# Altium schematic sheet Peripherals.SchDoc: Peripherals
size A4; Date: 9/24/2014; Author: P.A.; CompanyName: STMicroelectronics; Organization: Microcontrollers Division; Address1: 12, Rue Jules HOROWITZ; Address2: 38019 Grenoble; Address3: FRANCE; DocumentNumber: MB1189; Revision: B-07; SheetNumber: 11; SheetTotal: 13; Project: STM32F469I-DISCO
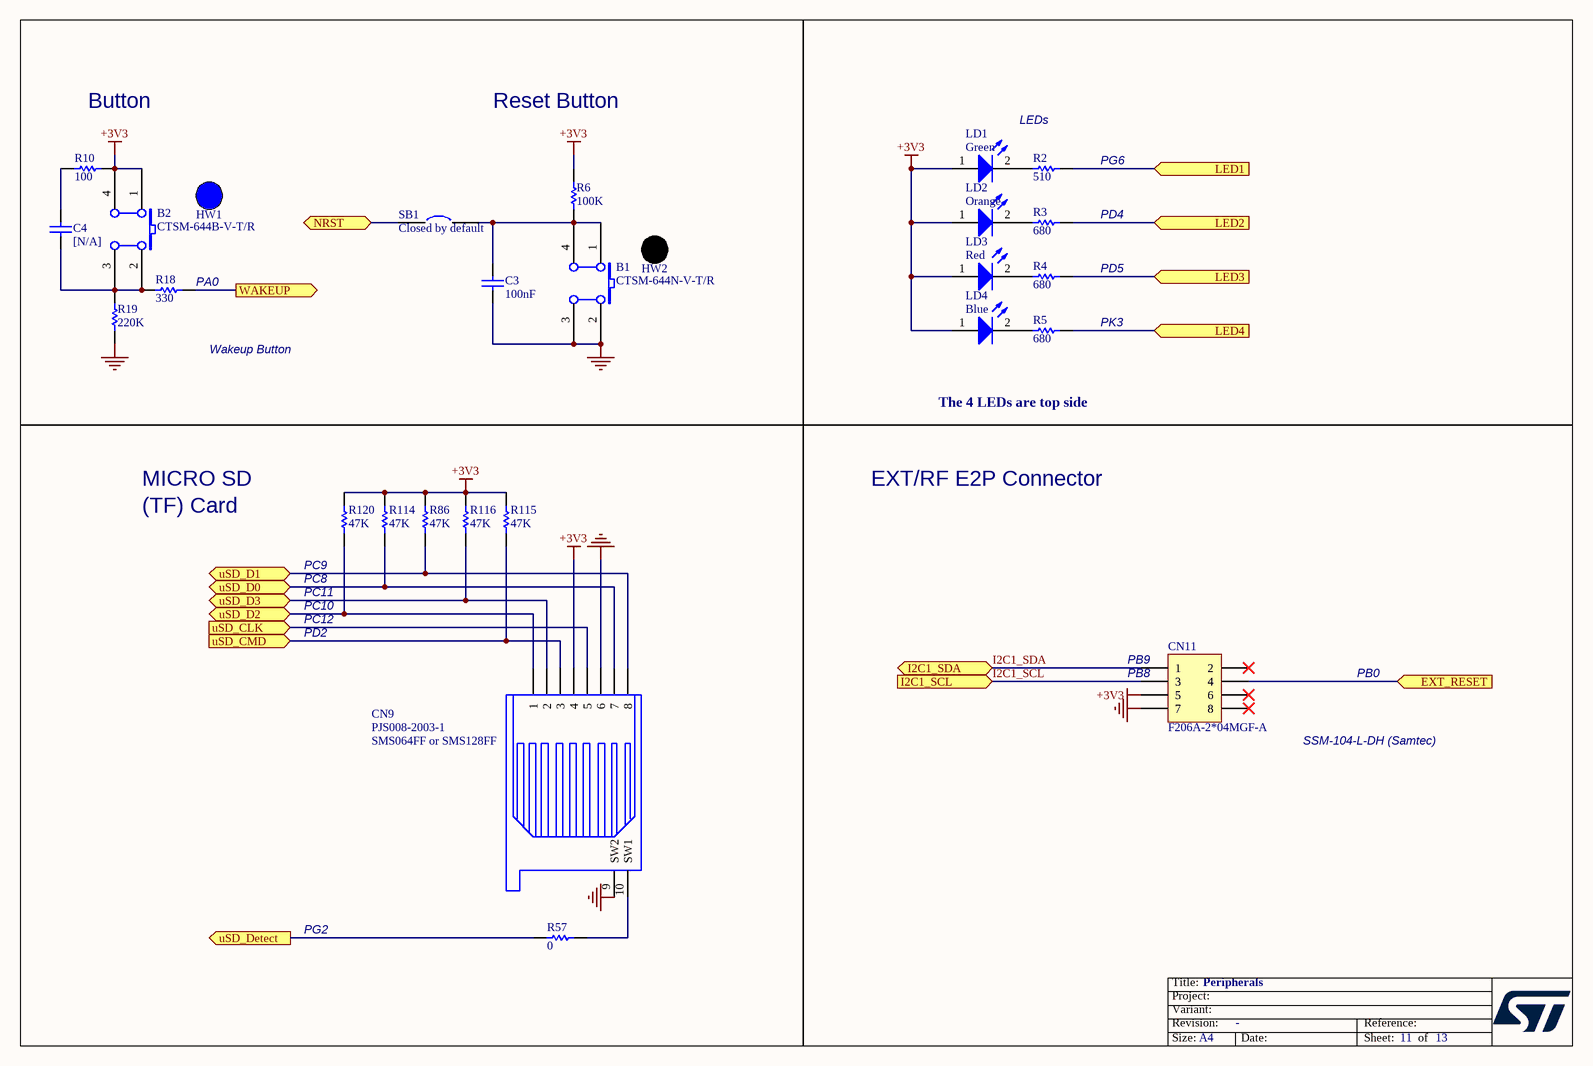
[diagram p0: Peripherals.SchDoc]

## Parts
B1  CTSM-644N-V-T/R  [PB10]
B2  CTSM-644B-V-T/R  [PB10]
C3  100nF  [0402C]
C4  [N/A]  [0603C]
CN9  PJS008-2003-1  [MSD_PJS008_]
CN11  F206A-2*04MGF-A  [SSM-104-L-DH]
HW1  BUTTON_HAT_BLUE  (value not drawn)  (mechanical)
HW2  BUTTON_HAT_BLACK  (value not drawn)  (mechanical)
LD1  Green  [0603D]
LD2  Orange  [0603D]
LD3  Red  [0603D]
LD4  Blue  [0603D]
R2  510  [0603R]
R3  680  [0603R]
R4  680  [0603R]
R5  680  [0603R]
R6  100K  [0603R]
R10  100  [0603R]
R18  330  [0603R]
R19  220K  [0603R]
R57  0  [0603R]
R86  47K  [0603R]
R114  47K  [0603R]
R115  47K  [0603R]
R116  47K  [0603R]
R120  47K  [0603R]
SB1  Closed by default  [SB_0603]

## Ports
EXT_RESET (in), I2C1_SCL (in), I2C1_SDA (bidir), LED1 (in), LED2 (in), LED3 (in), LED4 (in), NRST (bidir), uSD_CLK (in), uSD_CMD (in), uSD_D0 (bidir), uSD_D1 (bidir), uSD_D2 (bidir), uSD_D3 (bidir), uSD_Detect (out), WAKEUP (out)

## Nets
+3V3: B2.1(A0) B2.4(A1) CN9.4 CN11.5 LD1.1(A) LD2.1(A) LD3.1(A) LD4.1(A) R6.1 R10.1 R86.1 R114.1 R115.1 R116.1 R120.1
GND: B1.2(B0) B1.3(B1) C3.1 CN9.6 CN9.9(SW2) CN11.7 R19.2
EXT_RESET: CN11.4 ; port EXT_RESET
I2C1_SCL: CN11.3 ; port I2C1_SCL
I2C1_SDA: CN11.1 ; port I2C1_SDA
LED1: R2.1 ; port LED1
LED2: R3.1 ; port LED2
LED3: R4.1 ; port LED3
LED4: R5.1 ; port LED4
NRST: SB1.1 ; port NRST
uSD_CLK: CN9.5 ; port uSD_CLK
uSD_CMD: CN9.3 R115.2 ; port uSD_CMD
uSD_D0: CN9.7 R114.2 ; port uSD_D0
uSD_D1: CN9.8 R86.2 ; port uSD_D1
uSD_D2: CN9.1 R120.2 ; port uSD_D2
uSD_D3: CN9.2 R116.2 ; port uSD_D3
uSD_Detect: R57.1 ; port uSD_Detect
WAKEUP: R18.2 ; port WAKEUP
NetB1_1: B1.1(A0) B1.4(A1) C3.2 R6.2 SB1.2
NetB2_2: B2.2(B0) B2.3(B1) C4.2 R18.1 R19.1
NetC4_1: C4.1 R10.2
NetCN9_10: CN9.10(SW1) R57.2
NetLD1_2: LD1.2(K) R2.2
NetLD2_2: LD2.2(K) R3.2
NetLD3_2: LD3.2(K) R4.2
NetLD4_2: LD4.2(K) R5.2

Not connected (* = marked no-connect by the designer): CN11 2* 6* 8*

## Notes on the sheet
- Button
- Reset Button
- LEDs
- (near R2) PG6
- PD4
- (near R18) PA0
- PD5
- PK3
- Wakeup Button
- The 4 LEDs are top side
- MICRO SD
- (TF) Card
- EXT/RF E2P Connector
- (near R120) PC8
- (near R120) PC9
- PC11
- PC10
- PC12
- PD2
- (near CN11) PB9
- (near CN11) PB8
- PB0
- (near CN9) SMS064FF or SMS128FF
- (near CN11) SSM-104-L-DH (Samtec)
- PG2
- Title:
- Project:
- Size:
- Revision:
- Variant:
- A4
- -
- Date:
- Reference:
- Sheet:
- of

## Library data of the parts
B1 = SW PUSHBUTTON: Push-Button BLACK; Manuf_1: CHAU HUA; Ordered by: Subcon; Assembly: with Blue cap; Silkscreen: USER; Manuf_part_1: CTSM-644N-V-T/R; Value: CTSM-644N-V-T/R
B2 = SW PUSHBUTTON: Push-Button BLUE; Manuf_1: CHAU HUA; Ordered by: Subcon; Assembly: with Blue cap; Silkscreen: USER; Manuf_part_1: CTSM-644B-V-T/R; Value: CTSM-644B-V-T/R
C3 = CAP: Capacitor; Manuf_part_1: CC0402KRX7R7BB104; Manuf_1: YAGEO; Ordered by: Subcon; Published: 8-Jun-2000; Revision: July-2002: Re-released for DXP Platform.; Publisher: Altium Limited; Value: 100NF
C4 = CAP: Capacitor; Value: 100pF; Ordered by: Subcon; Fitted: NO; Published: 8-Jun-2000; Revision: July-2002: Re-released for DXP Platform.; Publisher: Altium Limited
CN9 = SMS016AFA5E: MicroSD Card Conn, Reversed-Type, Mnt Push-Push, Positionning holes; Manuf_1: Yamaichi; Ordered by: Subcon; Silkscreen: uSD; Manuf_Part_1: PJS008-2003-1
CN11 = SSM-104-L-DH: Header, 4-Pin, Dual row; Manuf_1: SAMTEC; Ordered by: Subcon; Silkscreen: RFEEPROM; Revision: 17-Jul-2002: Re-released for DXP Platform.; Publisher: Altium Limited; Manuf_Part_1: SSM-104-L-DH
HW1 = BUTTON_HAT_BLUE: switch hat,blue; Manuf_part_1: KTSC-62B; Manuf_1: CHAU HUA
HW2 = BUTTON_HAT_BLACK: switch hat,black; Manuf_part_1: KTSC-62K; Manuf_1: CHAU HUA
LD1 = LED2: Typical RED, GREEN, YELLOW, AMBER GaAs LED; Manuf_1: Everlight Electronics; Manuf_part_1: 19-217/G7C-AN1P2/3T; Ordered by: Subcon; ECCN_US/EU: EAR99/NEC; Published: 8-Jun-2000; Revision: July-2002: Re-released for DXP Platform.; Publisher: Altium Limited
LD2 = LED2: Typical RED, GREEN, YELLOW, AMBER GaAs LED; Manuf_1: Everlight Electronics; Manuf_part_1: 19-217/S2C-AM2N2VY/3T; Ordered by: Subcon; ECCN_US/EU: EAR99/NEC; Published: 8-Jun-2000; Revision: July-2002: Re-released for DXP Platform.; Publisher: Altium Limited
LD3 = LED2: Typical RED, GREEN, YELLOW, AMBER GaAs LED; Manuf_1: Everlight Electronics; Manuf_part_1: 19-217/R6C-AL1M2VY/3T; Ordered by: Subcon; ECCN_US/EU: EAR99/NEC; Published: 8-Jun-2000; Revision: July-2002: Re-released for DXP Platform.; Publisher: Altium Limited
LD4 = LED2: Typical RED, GREEN, YELLOW, AMBER GaAs LED; Manuf_1: Everlight Electronics; Manuf_part_1: 19-217/BHC-ZL1M2RY/3T; Ordered by: Subcon; ECCN_US/EU: EAR99/NEC; Published: 8-Jun-2000; Revision: July-2002: Re-released for DXP Platform.; Publisher: Altium Limited
R2 = Res1: Resistor; Manuf_1: YAGEO; Manuf_part_1: RC0603FR-07510RL; Ordered by: Subcon; Published: 8-Jun-2000; Revision: July-2002: Re-released for DXP Platform.; Publisher: Altium Limited; Value: 510
R3-R5 = Res1: Resistor; Manuf_1: YAGEO; Manuf_part_1: RC0603FR-07680RL; Ordered by: Subcon; Published: 8-Jun-2000; Revision: July-2002: Re-released for DXP Platform.; Publisher: Altium Limited; Value: 680
R6 = res1: Resistor; Manuf_1: YAGEO; Manuf_part_1: RC0603FR-07100KL; Ordered by: Subcon; Published: 8-Jun-2000; Revision: July-2002: Re-released for DXP Platform.; Publisher: Altium Limited; Value: 100K
R10 = Res1: Resistor; Manuf_1: YAGEO; Manuf_part_1: RC0603FR-07100RL; Ordered by: Subcon; Published: 8-Jun-2000; Revision: July-2002: Re-released for DXP Platform.; Publisher: Altium Limited; Value: 100
R18 = Res1: Resistor; Manuf_1: YAGEO; Manuf_part_1: RC0603FR-07330RL; Ordered by: Subcon; Published: 8-Jun-2000; Revision: July-2002: Re-released for DXP Platform.; Publisher: Altium Limited; Value: 330
R19 = res1: Resistor; Manuf_1: YAGEO; Manuf_part_1: RC0603FR-07220KL; Ordered by: Subcon; Published: 8-Jun-2000; Revision: July-2002: Re-released for DXP Platform.; Publisher: Altium Limited; Value: 220k
R57 = Res1: Resistor; Manuf_1: YAGEO; Manuf_part_1: RC0603JR-070RL; Ordered by: Subcon; Published: 8-Jun-2000; Revision: July-2002: Re-released for DXP Platform.; Publisher: Altium Limited; Value: 0
R86 R114-R116 R120 = res1: Resistor; Manuf_1: YAGEO; Manuf_part_1: RC0603FR-0747KL; Ordered by: Subcon; Published: 8-Jun-2000; Revision: July-2002: Re-released for DXP Platform.; Publisher: Altium Limited; Value: 47K
SB1 = Circuit Breaker: Ordered by: Subcon; Comments: Solder bridge; Published: 24-Mar-1999; Revision: July-2002: Re-released for DXP Platform.; Publisher: Altium Limited